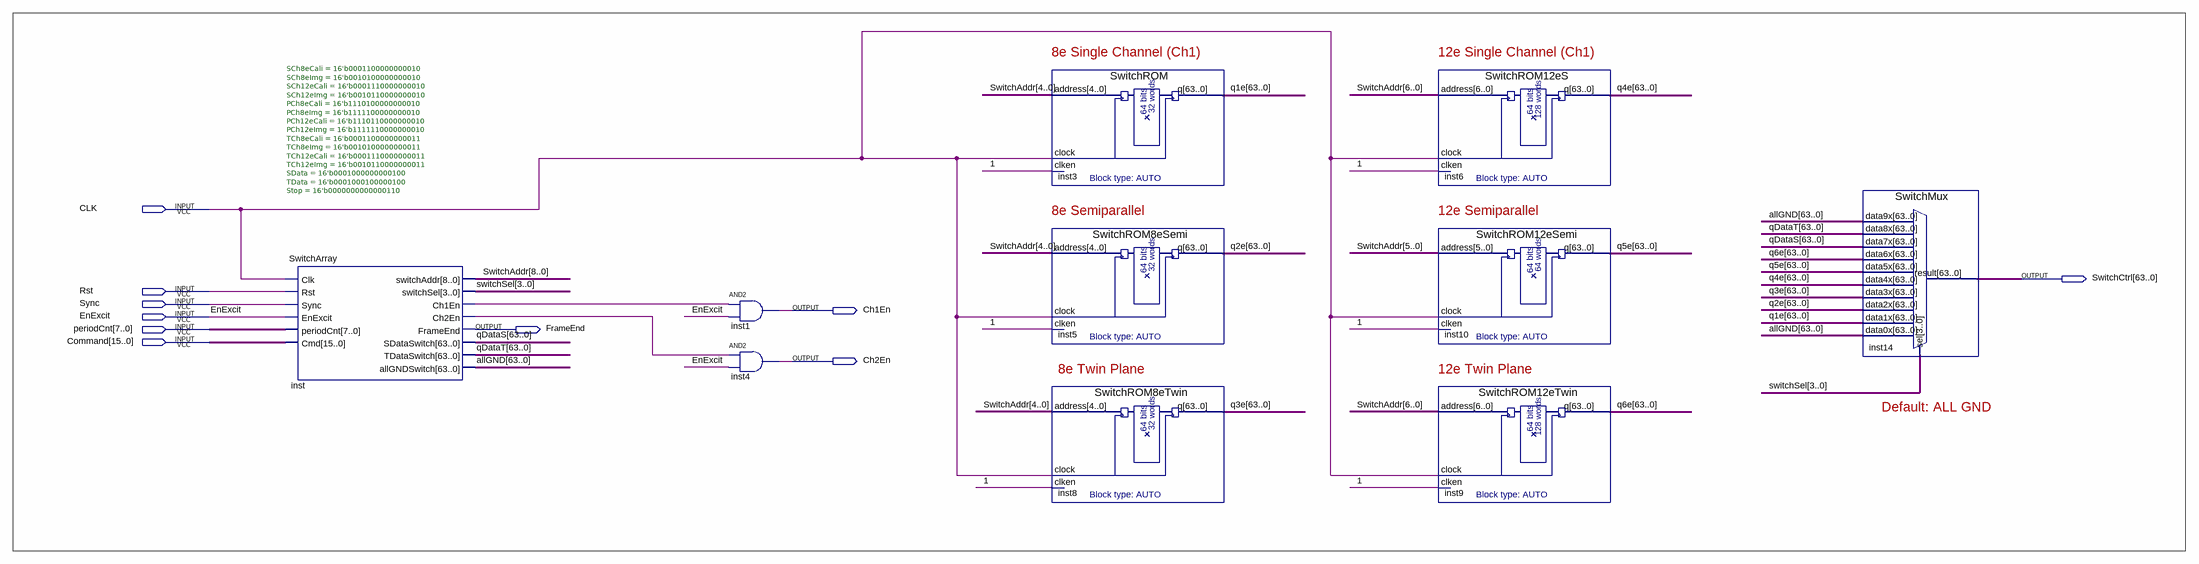
[diagram p0: schematic sheet]
// Quartus schematic SwitchCtrl.bdf as structural Verilog: 10 symbols, 10 pins
module SwitchCtrl (
  input  CLK,
  input  Rst,
  input  Sync,
  input  EnExcit,
  input  [7:0] periodCnt,
  input  [15:0] Command,
  output [63:0] SwitchCtrl,
  output Ch1En,
  output FrameEnd,
  output Ch2En
);

  wire \1 , inst_ch1en, inst_ch2en;
  wire [3:0] switchSel;
  wire [8:0] SwitchAddr;
  wire [63:0] allGND, q1e, q2e, q3e, q4e, q5e, q6e, qDataS, qDataT;

  SwitchArray #(.SCh8eCali(16'b0001100000000010), .SCh8eImg(16'b0010100000000010), .SCh12eCali(16'b0001110000000010), .SCh12eImg(16'b0010110000000010), .PCh8eCali(16'b1110100000000010), .PCh8eImg(16'b1111100000000010), .PCh12eCali(16'b1110110000000010), .PCh12eImg(16'b1111110000000010), .TCh8eCali(16'b0001100000000011), .TCh8eImg(16'b0010100000000011), .TCh12eCali(16'b0001110000000011), .TCh12eImg(16'b0010110000000011), .SData(16'b0001000000000100), .TData(16'b0001000100000100), .Stop(16'b0000000000000110)) inst (
    .Clk(CLK), .Rst(Rst), .Sync(Sync), .EnExcit(EnExcit), .periodCnt(periodCnt), .Cmd(Command),
    .switchAddr(SwitchAddr), .switchSel(switchSel), .Ch1En(inst_ch1en), .Ch2En(inst_ch2en),
    .FrameEnd(FrameEnd), .SDataSwitch(qDataS), .TDataSwitch(qDataT), .allGNDSwitch(allGND));
  and inst1 (Ch1En, inst_ch1en, EnExcit);
  and inst4 (Ch2En, inst_ch2en, EnExcit);
  SwitchROM inst3 (.address(SwitchAddr[4:0]), .clock(CLK), .clken(\1 ), .q(q1e));
  SwitchROM8eSemi inst5 (.address(SwitchAddr[4:0]), .clock(CLK), .clken(\1 ), .q(q2e));
  SwitchROM8eTwin inst8 (.address(SwitchAddr[4:0]), .clock(CLK), .clken(\1 ), .q(q3e));
  SwitchROM12eS inst6 (.address(SwitchAddr[6:0]), .clock(CLK), .clken(\1 ), .q(q4e));
  SwitchROM12eSemi inst10 (.address(SwitchAddr[5:0]), .clock(CLK), .clken(\1 ), .q(q5e));
  SwitchROM12eTwin inst9 (.address(SwitchAddr[6:0]), .clock(CLK), .clken(\1 ), .q(q6e));
  SwitchMux inst14 (
    .data9x(allGND), .data8x(qDataT), .data7x(qDataS), .data6x(q6e), .data5x(q5e), .data4x(q4e),
    .data3x(q3e), .data2x(q2e), .data1x(q1e), .data0x(allGND), .sel(switchSel), .result(SwitchCtrl));

  // Notes on the sheet:
  //   8e Single Channel (Ch1)
  //   12e Single Channel (Ch1)
  //   8e Semiparallel
  //   12e Semiparallel
  //   8e Twin Plane
  //   12e Twin Plane
  //   Default: ALL GND
endmodule
